# EAGLE design RS485-Breakout-v13 (EAGLE 6.2)
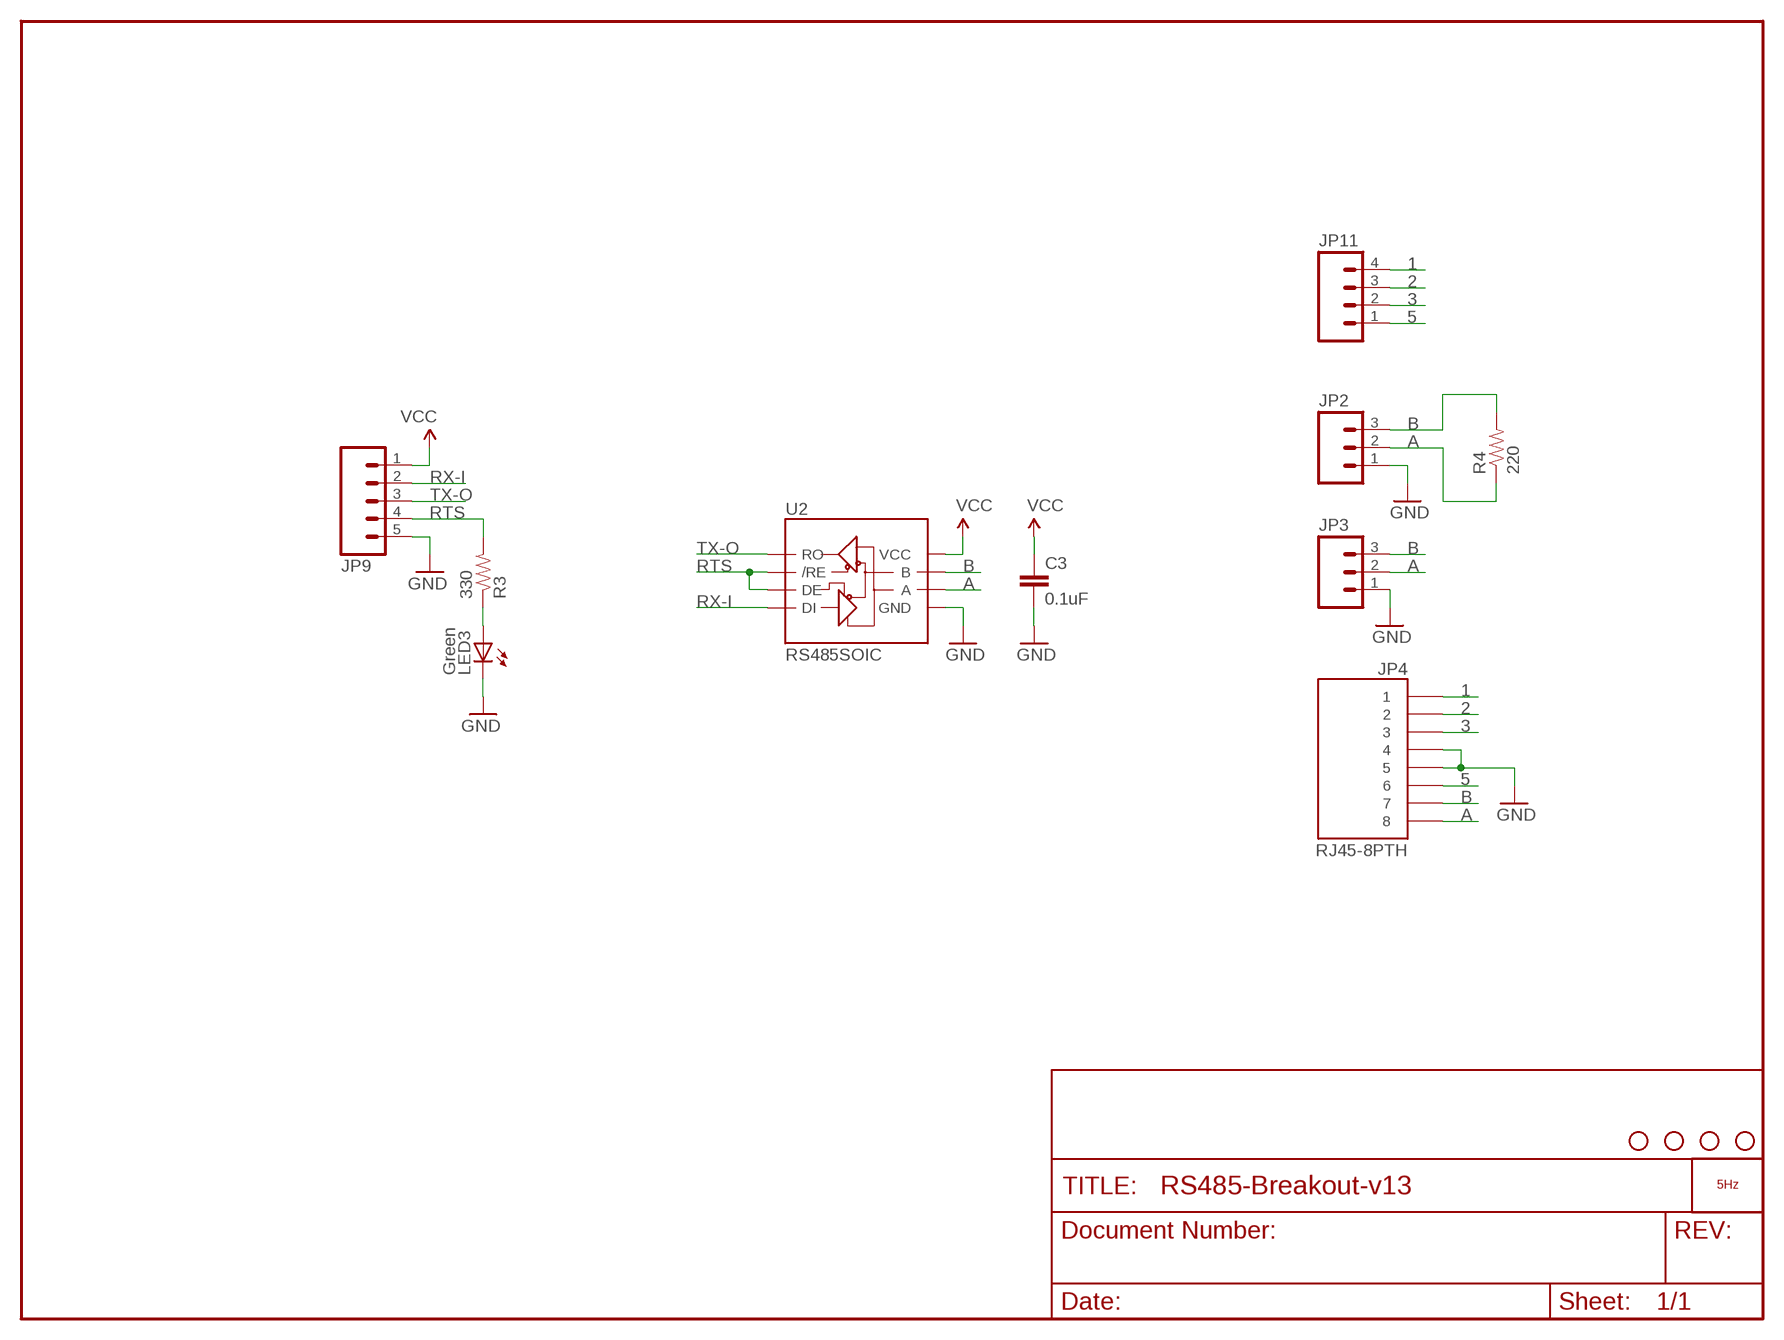
[diagram p0: schematic, sheet 1]

## Parts
C3  0.1uF  CAP0402-CAP  [0402-CAP]
JP1  STAND-OFF  [STAND-OFF]
JP2  M03SCREW  [SCREWTERMINAL-3.5MM-3]
JP3  M03PTH  [1X03]
JP4  RJ45-8PTH  [RJ45-8]
JP6  STAND-OFF  [STAND-OFF]
JP7  STAND-OFF  [STAND-OFF]
JP8  STAND-OFF  [STAND-OFF]
JP9  M05PTH  [1X05]
JP11  M04PTH  [1X04]
LED3  Green  LED0603  [LED-0603]
LOGO1  LOGO_5HZ_CIRC_3.5MM  [5HZ_LOGO_CIRC_3.5MM]
R3  330  RESISTOR0402-RES  [0402-RES]
R4  220  RESISTOR0402-RES  [0402-RES]
U2  RS485SOIC  [SO08]

## Nets
1: JP4.1 JP11.4
2: JP4.2 JP11.3
3: JP4.3 JP11.2
5: JP4.6 JP11.1
A: JP2.2 JP3.2 JP4.8 R4.1 U2.6(A)
B: JP2.3 JP3.3 JP4.7 R4.2 U2.7(B)
GND [power]: C3.2 JP2.1 JP3.1 JP4.4 JP4.5 JP9.5 LED3.C U2.5(GND)
N$4: LED3.A R3.1
RTS: JP9.4 R3.2 U2.2(/RE) U2.3(DE)
RX-I: JP9.2 U2.4(DI)
TX-O: JP9.3 U2.1(RO)
VCC [power]: C3.1 JP9.1 U2.8(VCC)

## Library data of the parts
C3 = SparkFun:CAP: Capacitor Standard 0603 ceramic capacitor, and 0.1" leaded capacitor.
JP1 JP6-JP8 = SparkFun:STAND-OFF: Stand Off This is the mechanical footprint for a #4 phillips button head screw. Use the keepout ring to avoid running the screw head into surrounding components. SKU : PRT-00447
JP2 JP3 = SparkFun:M03: Header 3 Standard 3-pin 0.1" header. Use with straight break away headers (SKU : PRT-00116), right angle break away headers (PRT-00553), swiss pins (PRT-00743), machine pins (PRT-00117), and female headers (PRT-00115). Molex polarized connector foot print use with SKU : PRT-08232 with associated crimp pins and housings.
JP4 = SparkFun:RJ45-8: RJ45 Jack Simple RJ45, 8-pin connection - connector for common Cat5, Cat5e, and Cat6 Ethernet cables. Footprint not yet proven in production. Connector sku is PRT-00643; Breakout PCB sku is BOB-00716.
JP9 = SparkFun:M05: Header 5 Standard 5-pin 0.1" header. Use with straight break away headers (SKU : PRT-00116), right angle break away headers (PRT-00553), swiss pins (PRT-00743), machine pins (PRT-00117), and female headers (PRT-00115). Molex polarized connector foot print use with SKU : PRT-08230 with associated crimp pins and housings.
JP11 = SparkFun:M04: Header 4 Standard 4-pin 0.1" header. Use with straight break away headers (SKU : PRT-00116), right angle break away headers (PRT-00553), swiss pins (PRT-00743), machine pins (PRT-00117), and female headers (PRT-00115). Molex polarized connector foot print use with SKU : PRT-08231 with associated crimp pins and housings.
LED3 = SparkFun:LED: LEDs Standard schematic elements and footprints for 5mm, 3mm, 1206, and 0603 sized LEDs. 5mm - Spark Fun Electronics SKU : COM-00529 (and others)
LOGO1 = 5hz-electronica:LOGO_5HZ: Logotipo 5Hz "según Pedro"
R3 R4 = SparkFun:RESISTOR: Resistor Basic schematic elements and footprints for 0603, 1206, and PTH 1/10th watt (small) resistors.
U2 = SparkFun:RS485

## Net classes
0 default: width 0.203 mm
1 power: width 0.254 mm

## Board
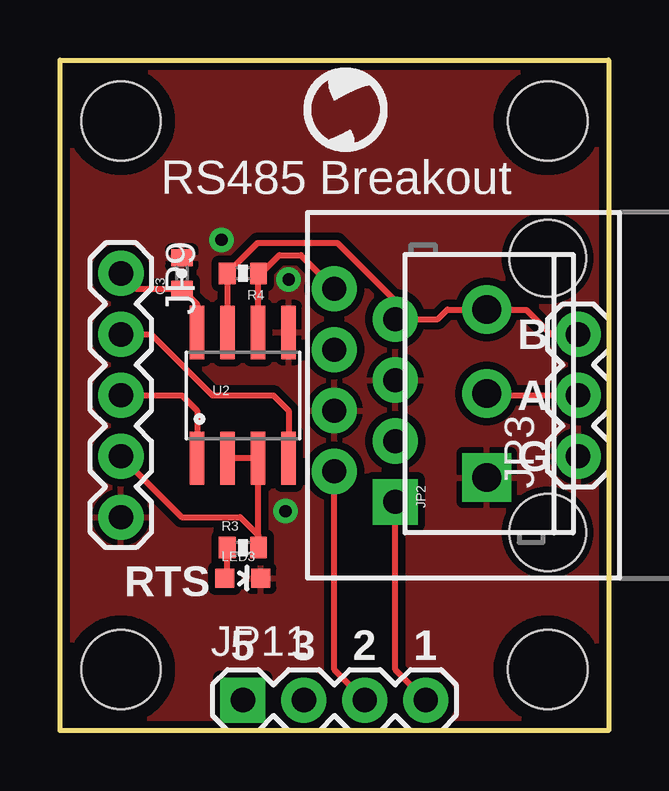
[diagram p1: board, top side]
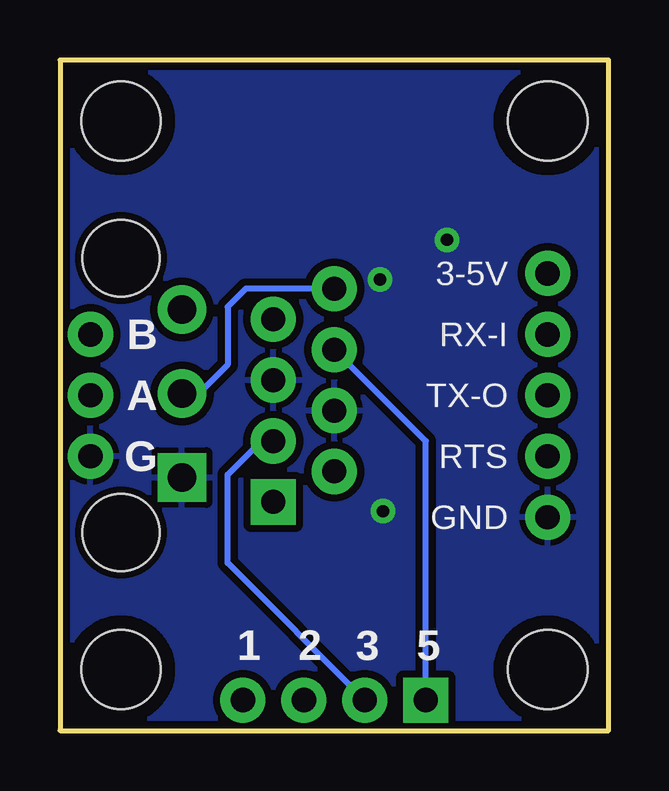
[diagram p2: board, bottom side, seen from below]

Size 22.86 x 27.94 mm. Coordinates in mm from the lower left corner, seen from the top.
Outline: 22.86,0 0,0 0,27.94 22.86,27.94 22.86,0
Copper layers (1*16): Top 0.035mm / dielectric 1.5mm / Bottom 0.035mm
Design rules: minimum track width 8mil, minimum drill 20mil, track to track 8mil, track to pad 8mil, pad to pad 8mil, via to via 8mil, smd to smd 8mil, copper to edge 10mil, drill to drill 8mil, minimum pad ring 12mil, minimum via ring 10mil, stop-mask expansion 4mil, vias tented up to drill 20mil, thermal gap 10mil

### Footprints (pad centres in the part's own frame; a part is rotated, then mirrored left to right if it is on the bottom)
0402-CAP = smd 0.7 x 0.9: 1 -0.65,0; 2 0.65,0
STAND-OFF = hole 3.302: 0,0
SCREWTERMINAL-3.5MM-3 = drill 1.2 pad 2.032 square: 1 0,0 | drill 1.2 pad 2.032: 2 3.5,0; 3 7,0
1X03 = drill 1.016 pad 1.88: 1 0,0; 2 2.54,0; 3 5.08,0
RJ45-8 = drill 1 pad 1.88 square: 1 -4.445,6.35 | drill 1 pad 1.88: 2 -3.175,8.89; 3 -1.905,6.35; 4 -0.635,8.89; 5 0.635,6.35; 6 1.905,8.89; 7 3.175,6.35; 8 4.445,8.89 | hole 3.2: -5.715,0; 5.715,0
1X05 = drill 1.016 pad 1.88: 1 0,0; 2 2.54,0; 3 5.08,0; 4 7.62,0; 5 10.16,0
1X04 = drill 1.016 pad 1.88 square: 1 0,0 | drill 1.016 pad 1.88: 2 2.54,0; 3 5.08,0; 4 7.62,0
LED-0603 = smd 0.8 x 0.8: A 0,-0.75; C 0,0.75
0402-RES = smd 0.7 x 0.9: 1 -0.65,0; 2 0.65,0
SO08 = smd 0.61 x 2.21: 1 -1.905,-2.616; 2 -0.635,-2.616; 3 0.635,-2.616; 4 1.905,-2.616; 5 1.905,2.616; 6 0.635,2.616; 7 -0.635,2.616; 8 -1.905,2.616

### Placement (x,y rotation side)
C3  5.08,19.05 90 top
JP1  2.54,25.4 0 top
JP2  17.78,10.54 90 top
JP3  21.59,11.43 90 top
JP4  20.32,13.97 90 top
JP6  2.54,2.54 0 top
JP7  20.32,25.4 0 top
JP8  20.32,2.54 0 top
JP9  2.54,19.05 270 top
JP11  7.62,1.27 0 top
LED3  7.62,6.35 270 top
LOGO1  10.16,24.13 0 top
R3  7.62,7.62 0 top
R4  7.62,19.05 180 top
U2  7.62,13.97 0 top

### Tracks (layer width: path | path; a pad name or v marks a point on that pad's centre or on a via)
1
  Top 0.254: JP4.1 13.97,2.54 JP11.4
2
  Top 0.254: JP4.2 11.43,2.54 JP11.3
3
  Bottom 0.254: JP4.3 14.48,12.06 15.88,10.67 15.88,6.99 JP11.2
5
  Bottom 0.254: JP4.6 7.62,12.06 JP11.1
A
  Top 0.254: JP3.2 17.85,13.97 JP2.2 | U2.6 R4.1 8.38,19.05 9.14,19.81 10.03,19.81 JP4.8
  Bottom 0.254: JP2.2 17.07,14.04 15.88,15.24 15.88,17.65 15.11,18.41 JP4.8
B
  Top 0.254: JP3.3 20.45,16.51 19.43,17.53 17.8,17.53 JP2.3 16.14,17.54 15.75,17.14 JP4.7 13.97,17.91 11.56,20.32 8.24,20.32 R4.2 6.99,19.04 U2.7
GND  (via drill 0.51)
  other vias: 9.4,9.14 9.53,18.8 6.73,20.45
  pour Bottom (isolate 0.305): 22.86,27.94 22.86,0 0,0 0,27.94
  pour Top (isolate 0.305): 22.86,27.94 22.86,0 0,0 0,27.94
N$4
  Top 0.254: R3.1 6.97,6.45 LED3.A
RTS
  Top 0.254: U2.2 U2.3 8.27,8.13 | 8.27,8.13 R3.2 | JP9.4 5.08,8.89 7.51,8.89 8.27,8.13
RX-I
  Top 0.254: U2.4 9.53,13.34 8.89,13.97 6.35,13.97 3.81,16.51 JP9.2
TX-O
  Top 0.254: U2.1 5.71,13.34 5.08,13.97 JP9.3
VCC
  Top 0.254: U2.8 5.71,17.77 C3.1 3.19,18.4 JP9.1

### Text on the board
tPlace: RS485 | Breakout | B | A | G | RTS | 5 | 3 | 2 | 1
bPlace: 3-5V | RX-I | B | A | TX-O | RTS | G | GND | 2 | 1 | 5 | 3